# Altium schematic sheet E77_E80.SchDoc
size 420 x 297 mm; SheetNumber: 1; SheetTotal: 1; SPICEModelCacheXSTIBOJF: <root> / <DocumentId>XSTIBOJF</DocumentId> / </root>
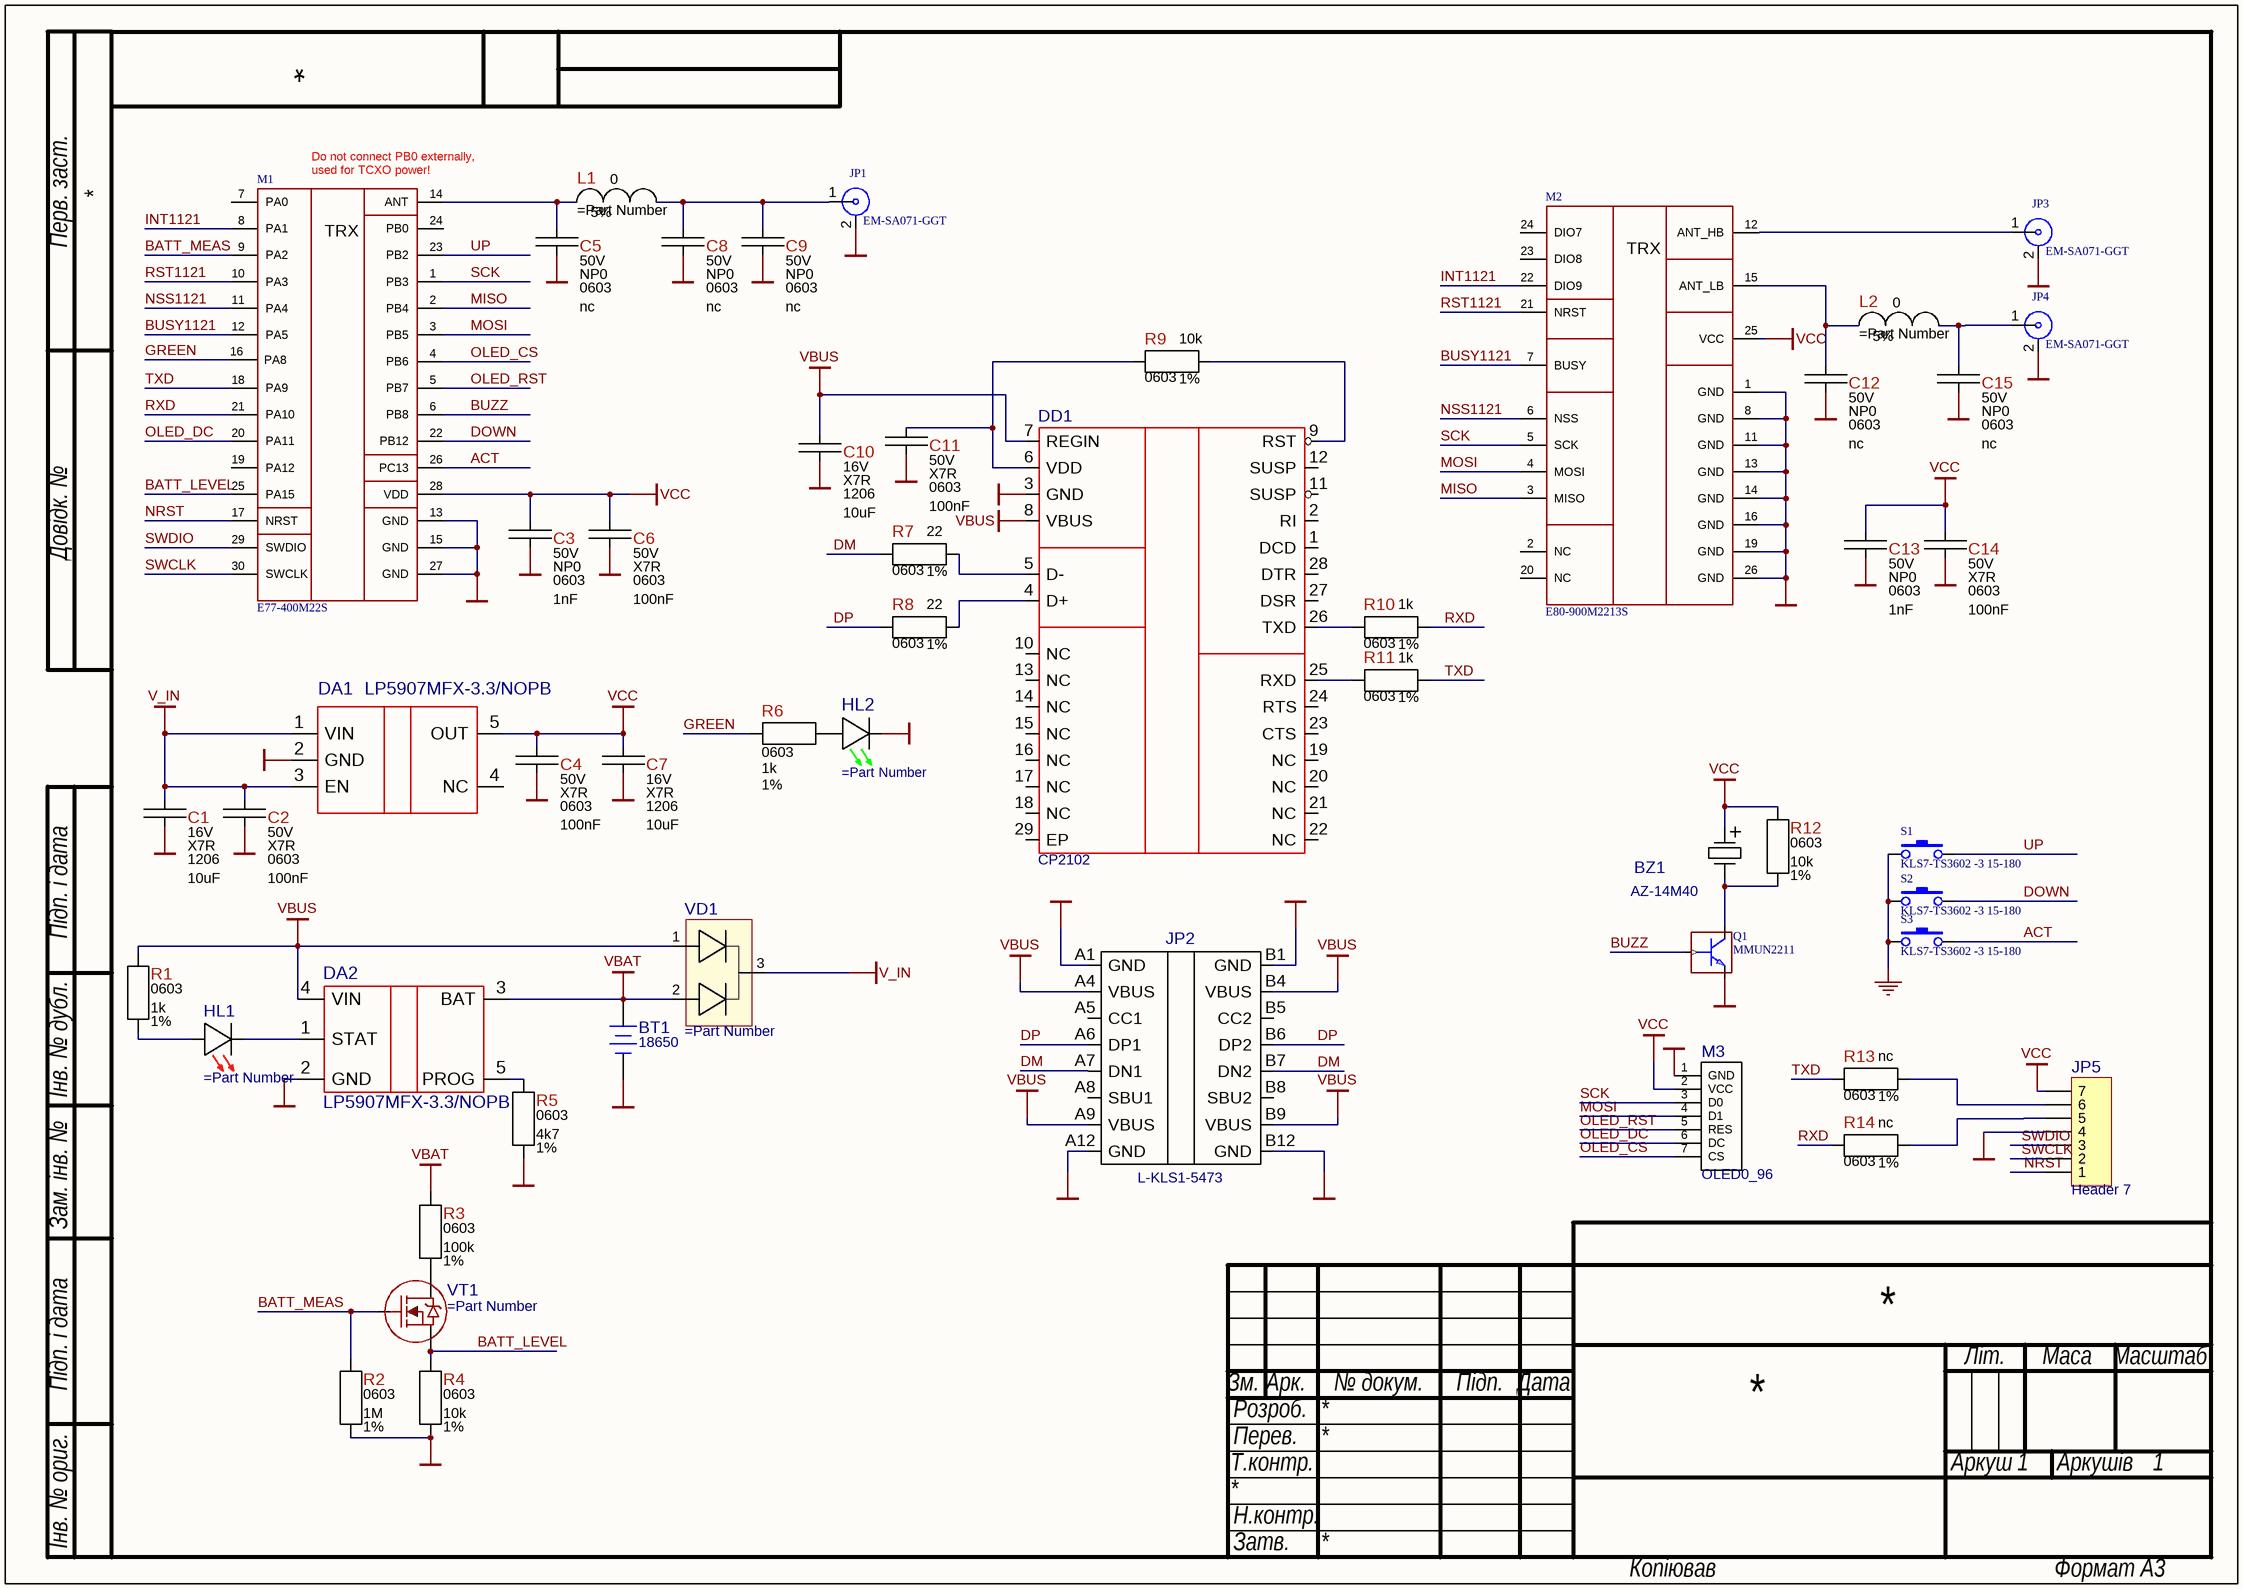
[diagram p0: E77_E80.SchDoc]

## Parts
BT1  18650  [18650]
BZ1  AZ-14M40  [AZ-14M40]
C1  Voltage: 16V  Dielectric Type: X7R  Package: 1206  [C-1206]  (hidden comment: 10uF)
C2  Voltage: 50V  Dielectric Type: X7R  Package: 0603  [C-0603]  (hidden comment: 100nF)
C3  Voltage: 50V  Dielectric Type: NP0  Package: 0603  [C-0603]  (hidden comment: 1nF)
C4  Voltage: 50V  Dielectric Type: X7R  Package: 0603  [C-0603]  (hidden comment: 100nF)
C5  Voltage: 50V  Dielectric Type: NP0  Package: 0603  [C-0603]  (hidden comment: nc)
C6  Voltage: 50V  Dielectric Type: X7R  Package: 0603  [C-0603]  (hidden comment: 100nF)
C7  Voltage: 16V  Dielectric Type: X7R  Package: 1206  [C-1206]  (hidden comment: 10uF)
C8  Voltage: 50V  Dielectric Type: NP0  Package: 0603  [C-0603]  (hidden comment: nc)
C9  Voltage: 50V  Dielectric Type: NP0  Package: 0603  [C-0603]  (hidden comment: nc)
C10  Voltage: 16V  Dielectric Type: X7R  Package: 1206  [C-1206]  (hidden comment: 10uF)
C11  Voltage: 50V  Dielectric Type: X7R  Package: 0603  [C-0603]  (hidden comment: 100nF)
C12  Voltage: 50V  Dielectric Type: NP0  Package: 0603  [C-0603]  (hidden comment: nc)
C13  Voltage: 50V  Dielectric Type: NP0  Package: 0603  [C-0603]  (hidden comment: 1nF)
C14  Voltage: 50V  Dielectric Type: X7R  Package: 0603  [C-0603]  (hidden comment: 100nF)
C15  Voltage: 50V  Dielectric Type: NP0  Package: 0603  [C-0603]  (hidden comment: nc)
DA1  LP5907MFX-3.3/NOPB  [SOT23-5]
DA2  LP5907MFX-3.3/NOPB  [SOT23-5]
DD1  CP2102
HL1  (no value)
HL2  (no value)
JP1  EM-SA071-GGT  [AMPHENOL_132357-11]
JP2  L-KLS1-5473  [L-KLS1-5473]
JP3  EM-SA071-GGT  [AMPHENOL_132357-11]
JP4  EM-SA071-GGT  [AMPHENOL_132357-11]
JP5  Header 7  [PLS1-7R]
L1  value 0  Tolerance: 5%  [L-0603]
L2  value 0  Tolerance: 5%  [L-0603]
M1  E77-400M22S  [E07-900M10S]
M2  E80-900M2213S  [E80]
M3  OLED0_96  [OLED096]
Q1  MMUN2211  [SOT-23]
R1  Package: 0603  Tolerance: 1%  [R-0603]  (hidden comment: 1k)
R2  Package: 0603  Tolerance: 1%  [R-0603]  (hidden comment: 1M)
R3  Package: 0603  Tolerance: 1%  [R-0603]  (hidden comment: 100k)
R4  Package: 0603  Tolerance: 1%  [R-0603]  (hidden comment: 10k)
R5  Package: 0603  Tolerance: 1%  [R-0603]  (hidden comment: 4k7)
R6  Package: 0603  Tolerance: 1%  [R-0603]  (hidden comment: 1k)
R7  Package: 0603  Tolerance: 1%  [R-0603]  (hidden comment: 22)
R8  Package: 0603  Tolerance: 1%  [R-0603]  (hidden comment: 22)
R9  Package: 0603  Tolerance: 1%  [R-0603]  (hidden comment: 10k)
R10  Package: 0603  Tolerance: 1%  [R-0603]  (hidden comment: 1k)
R11  Package: 0603  Tolerance: 1%  [R-0603]  (hidden comment: 1k)
R12  Package: 0603  Tolerance: 1%  [R-0603]  (hidden comment: 10k)
R13  Package: 0603  Tolerance: 1%  [R-0603]  (hidden comment: nc)
R14  Package: 0603  Tolerance: 1%  [R-0603]  (hidden comment: nc)
S1  KLS7-TS3602 -3 15-180  [KLS7-TS3602]
S2  KLS7-TS3602 -3 15-180  [KLS7-TS3602]
S3  KLS7-TS3602 -3 15-180  [KLS7-TS3602]
VD1  (no value)  [SOT-23]
VT1  (no value)

## Nets
GND: BT1.2(-) C1.2 C2.2 C3.2 C4.2 C5.2 C6.2 C7.2 C8.2 C9.2 C10.2 C11.2 C12.2 C13.2 C14.2 C15.2 DA1.2(GND) DA2.2(GND) DD1.3(GND) HL2.1 JP1.2 JP2.A1(GND) JP2.A12(GND) JP2.B1(GND) JP2.B12(GND) JP3.2 JP4.2 JP5.4 M1.13(GND) M1.15(GND) M1.27(GND) M2.1(GND) M2.8(GND) M2.11(GND) M2.13(GND) M2.14(GND) M2.16(GND) M2.19(GND) M2.26(GND) M3.1(GND) Q1.2(EMITTER) R2.2 R4.2 R5.2 S1.1 S2.1 S3.1
V_IN: C1.1 C2.1 DA1.1(VIN) DA1.3(EN) VD1.3
VBAT: BT1.1(+) DA2.3(BAT) R3.1 VD1.2
VBUS: C10.1 DA2.4(VIN) DD1.7(REGIN) DD1.8(VBUS) JP2.A4(VBUS) JP2.A9(VBUS) JP2.B4(VBUS) JP2.B9(VBUS) R1.1 VD1.1
VCC: BZ1.1 C3.1 C4.1 C6.1 C7.1 C13.1 C14.1 DA1.5(OUT) JP5.7 M1.28(VDD) M2.25(VCC) M3.2(VCC) R12.1
\: M1.26(PC13) S3.2  [also labelled ACT]
BATT_LEVEL: M1.25(PA15) R4.1 VT1.2(S)
BATT_MEAS: M1.9(PA2) R2.1 VT1.1(G)
BUSY1121: M1.12(PA5) M2.7(BUSY)
BUZZ: M1.6(PB8) Q1.1(BASE)
DM: JP2.A7(DN1) JP2.B7(DN2) R7.1
DOWN: M1.22(PB12) S2.2
DP: JP2.A6(DP1) JP2.B6(DP2) R8.1
GREEN: M1.16(PA8) R6.1
INT1121: M1.8(PA1) M2.22(DIO9)
MISO: M1.2(PB4) M2.3(MISO)
MOSI: M1.3(PB5) M2.4(MOSI) M3.4(D1)
NRST: JP5.1 M1.17(NRST)
NSS1121: M1.11(PA4) M2.6(NSS)
OLED_CS: M1.4(PB6) M3.7(CS)
OLED_DC: M1.20(PA11) M3.6(DC)
OLED_RST: M1.5(PB7) M3.5(RES)
RST1121: M1.10(PA3) M2.21(NRST)
RXD: M1.21(PA10) R10.2 R14.1
SCK: M1.1(PB3) M2.5(SCK) M3.3(D0)
SWCLK: JP5.2 M1.30(SWCLK)
SWDIO: JP5.3 M1.29(SWDIO)
TXD: M1.18(PA9) R11.2 R13.1
UP: M1.23(PB2) S1.2
NetBZ1_2: BZ1.2 Q1.3(COLLECTOR) R12.2
NetC5_1: C5.1 L1.2 M1.14(ANT)
NetC8_1: C8.1 C9.1 L1.1
NetC11_1: C11.1 DD1.6(VDD) R9.1
NetC12_1: C12.1 L2.2 M2.15(ANT_LB)
NetC15_1: C15.1 JP4.1 L2.1
NetDA2_1: DA2.1(STAT) HL1.1
NetDA2_5: DA2.5(PROG) R5.1
NetDD1_4: DD1.4(D+) R8.2
NetDD1_5: DD1.5(D-) R7.2
NetDD1_9: DD1.9(RST) R9.2
NetDD1_25: DD1.25(RXD) R11.1
NetDD1_26: DD1.26(TXD) R10.1
NetHL1_2: HL1.2 R1.2
NetHL2_2: HL2.2 R6.2
NetJP3_1: JP3.1 M2.12(ANT_HB)
NetJP5_5: JP5.5 R14.2
NetJP5_6: JP5.6 R13.2
NetR3_2: R3.2 VT1.3(D)

Not connected (* = marked no-connect by the designer): DA1 4(NC); DD1 1(DCD) 2(RI) 10(NC) 11(SUSP) 12(SUSP) 13(NC) 14(NC) 15(NC) 16(NC) 17(NC) 18(NC) 19(NC) 20(NC) 21(NC) 22(NC) 23(CTS) 24(RTS) 27(DSR) 28(DTR) 29(EP); JP1 1; JP2 17(VSS) A5(CC1) A8(SBU1) B5(CC2) B8(SBU2); M1 7(PA0) 19(PA12) 24(PB0); M2 2(NC) 20(NC) 23(DIO8) 24(DIO7)

## Notes on the sheet
- (near M1) Do not connect PB0 externally,
  used for TCXO power!
- Перв. заст.
- Довідк. №
- Підп. і дата
- Інв. № дубл.
- Зам. інв. №
- Зм.
- Арк.
- № докум.
- Підп.
- Дата
- Літ.
- Маса
- Масштаб
- Т.контр.
- Перев.
- Розроб.
- Аркуш
- Аркушів
- Інв. № ориг.
- Н.контр.
- Затв.
- Копіював
- Формат А3
- (in symbol E77-400M22S) TRX
- (in symbol E80-XXXM2213S) TRX

## Library data of the parts
BT1 = Battery: Multicell Battery; Published: 24-Mar-1999; LatestRevisionDate: 17-Jul-2002; LatestRevisionNote: Re-released for DXP Platform.; PackageReference: BAT-2; Publisher: Altium Limited; PackageDescription: Battery; 2 Leads; Value: 18650
BZ1 = BUZ-AZ-14M40: Value: {Value}; Mounting  Method: THT
C1-C15 = NO-POLE-CAP: Part Number: *; Component Type: *; Manufacturer: *; Power Rating: *; Temperature Stability: *; Temperature Range: *; Suplier 1: *; Suplier Part Number 1: *; Tolerance: Tolerance
  C1 C7 C10: Value: 10uF
  C2 C4 C6 C11 C14: Value: 100nF
  C3 C13: Value: 1nF
  C5 C8 C9 C12 C15: Value: nc
DA1 = LP5907MFX-3.3/NOPB_1: Library Part: IC`s.SchLib; Manufacturer: Texas Instruments; Man#Part Num#: TPS61023DRLT; Value: {Value}; Mounting  Method: SMD; IC Type: PMIC; Part Number: LP5907MFX-3.3/NOPB; Footprint Part: IC-package.PcbLib; Package: SOT-563; Part Type: IC; Component Type: SMD; Temperature Range: -40°C ~ 125°C (TJ); URL: https://www.ti.com/general/docs/suppproductinfo.tsp?distId=10&gotoUrl=https%3A%2F%2Fwww.ti.com%2Flit%2Fgpn%2Ftps61023; Suplier 1: https://www.digikey.com.au/en/products/detail/texas-instruments/TPS61023DRLT/11310622?s=N4IgTCBcDaICoAUDKA2AjABjAZgCICUAZOEAXQF8g
DA2 = MCP73831-2ATI/OT: Library Part: IC`s.SchLib; Manufacturer: Texas Instruments; Man#Part Num#: TPS61023DRLT; Value: {Value}; Mounting  Method: SMD; IC Type: PMIC; Part Number: LP5907MFX-3.3/NOPB; Footprint Part: IC-package.PcbLib; Package: SOT-563; Part Type: IC; Component Type: SMD; Temperature Range: -40°C ~ 125°C (TJ); URL: https://www.ti.com/general/docs/suppproductinfo.tsp?distId=10&gotoUrl=https%3A%2F%2Fwww.ti.com%2Flit%2Fgpn%2Ftps61023; Suplier 1: https://www.digikey.com.au/en/products/detail/texas-instruments/TPS61023DRLT/11310622?s=N4IgTCBcDaICoAUDKA2AjABjAZgCICUAZOEAXQF8g
DD1 = CP2102: Mounting  Method: SMD; Value: CP2102; ComponentLink1Description: link; ComponentLink1URL: https://www.silabs.com/mcu/8-bit-microcontrollers/efm8-busy-bee/device.efm8bb21f16g-qfn20?tab=specs; Part Number: CP2102
HL1 = LED-R
HL2 = LED-G
JP1 JP3 JP4 = SMA: SMA Female R/A PCB Mount; Вид: Роз'єм
JP2 = L-KLS1-5473: Mounting  Method: SMD; Value: *
JP5 = Header 7: Header, 7-Pin; LatestRevisionDate: 17-Jul-2002; LatestRevisionNote: Re-released for DXP Platform.; Publisher: Altium Limited
L1 L2 = Ind: Package: 06.3
M2 = E80-XXXM2213S
Q1 = MMUN2211: Вид: Транзистор
R1-R14 = SMD_res: Part Number: *; Component Type: *; Manufacturer: *; Power Rating: *; Voltage: *; Temperature Stability: *; Temperature Range: *
  R1 R6 R10 R11: Value: 1k
  R2: Value: 1M
  R3: Value: 100k
  R4 R9 R12: Value: 10k
  R5: Value: 4k7
  R7 R8: Value: 22
  R13 R14: Value: nc
S1-S3 = SW-1: Вид: Кнопка; Робоча напруга: *
VD1 = Diode_SOT-23_dual
VT1 = N-ch_SOT23: Mounting  Method: SMD; Value: =Part Number